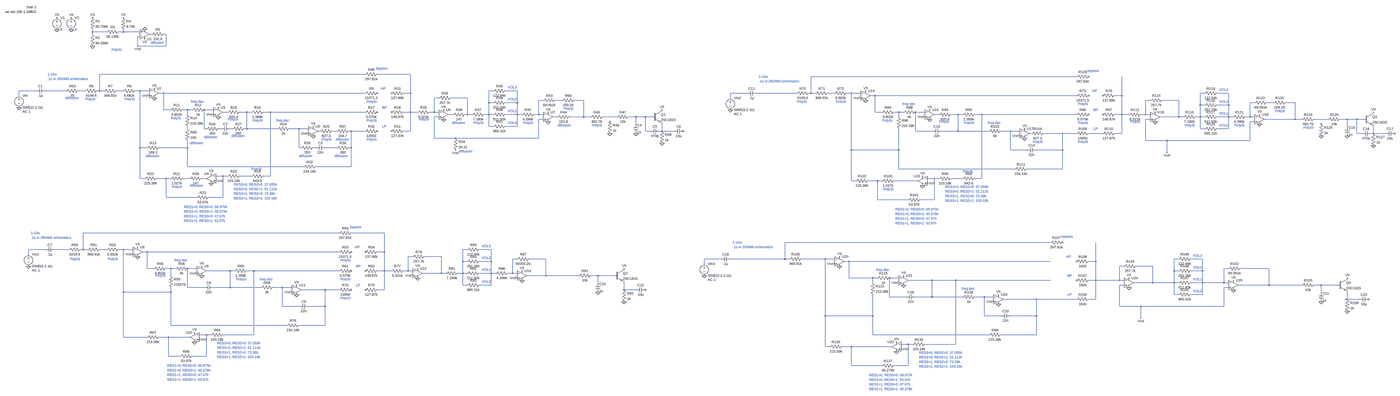
[diagram p0: schematic 8580.asc, whole sheet]
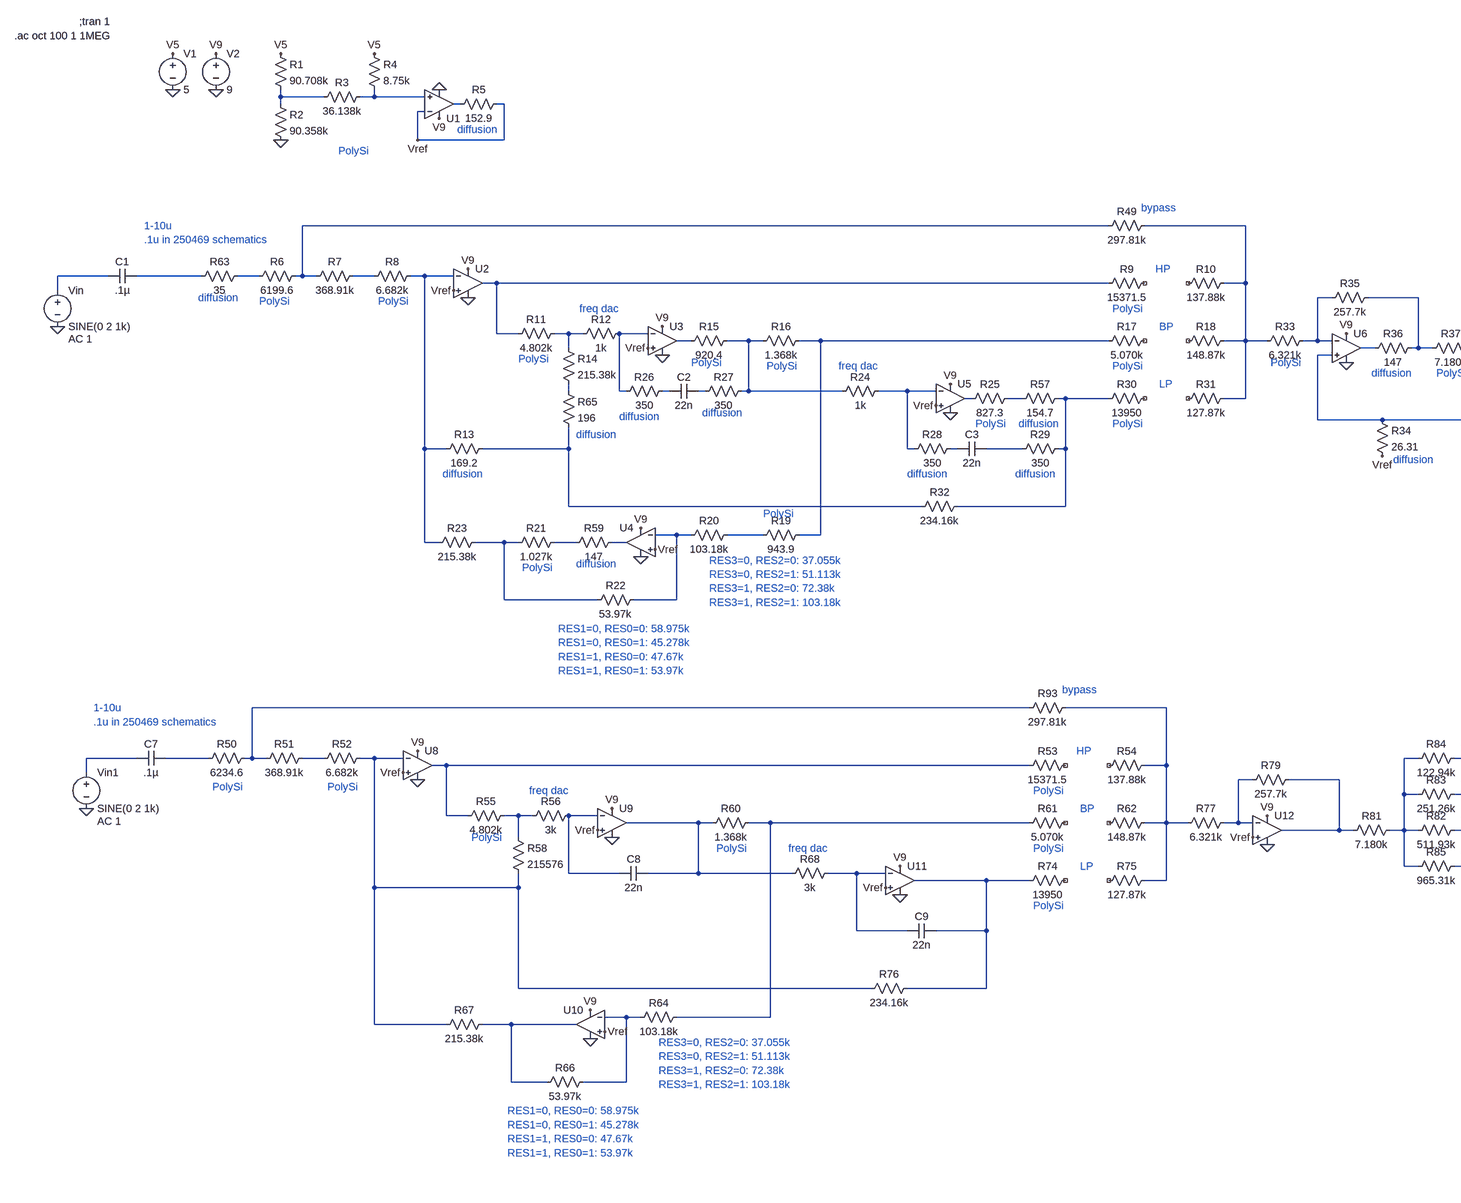
[diagram p1: schematic 8580.asc, part, row 1 of 1, column 1 of 3]
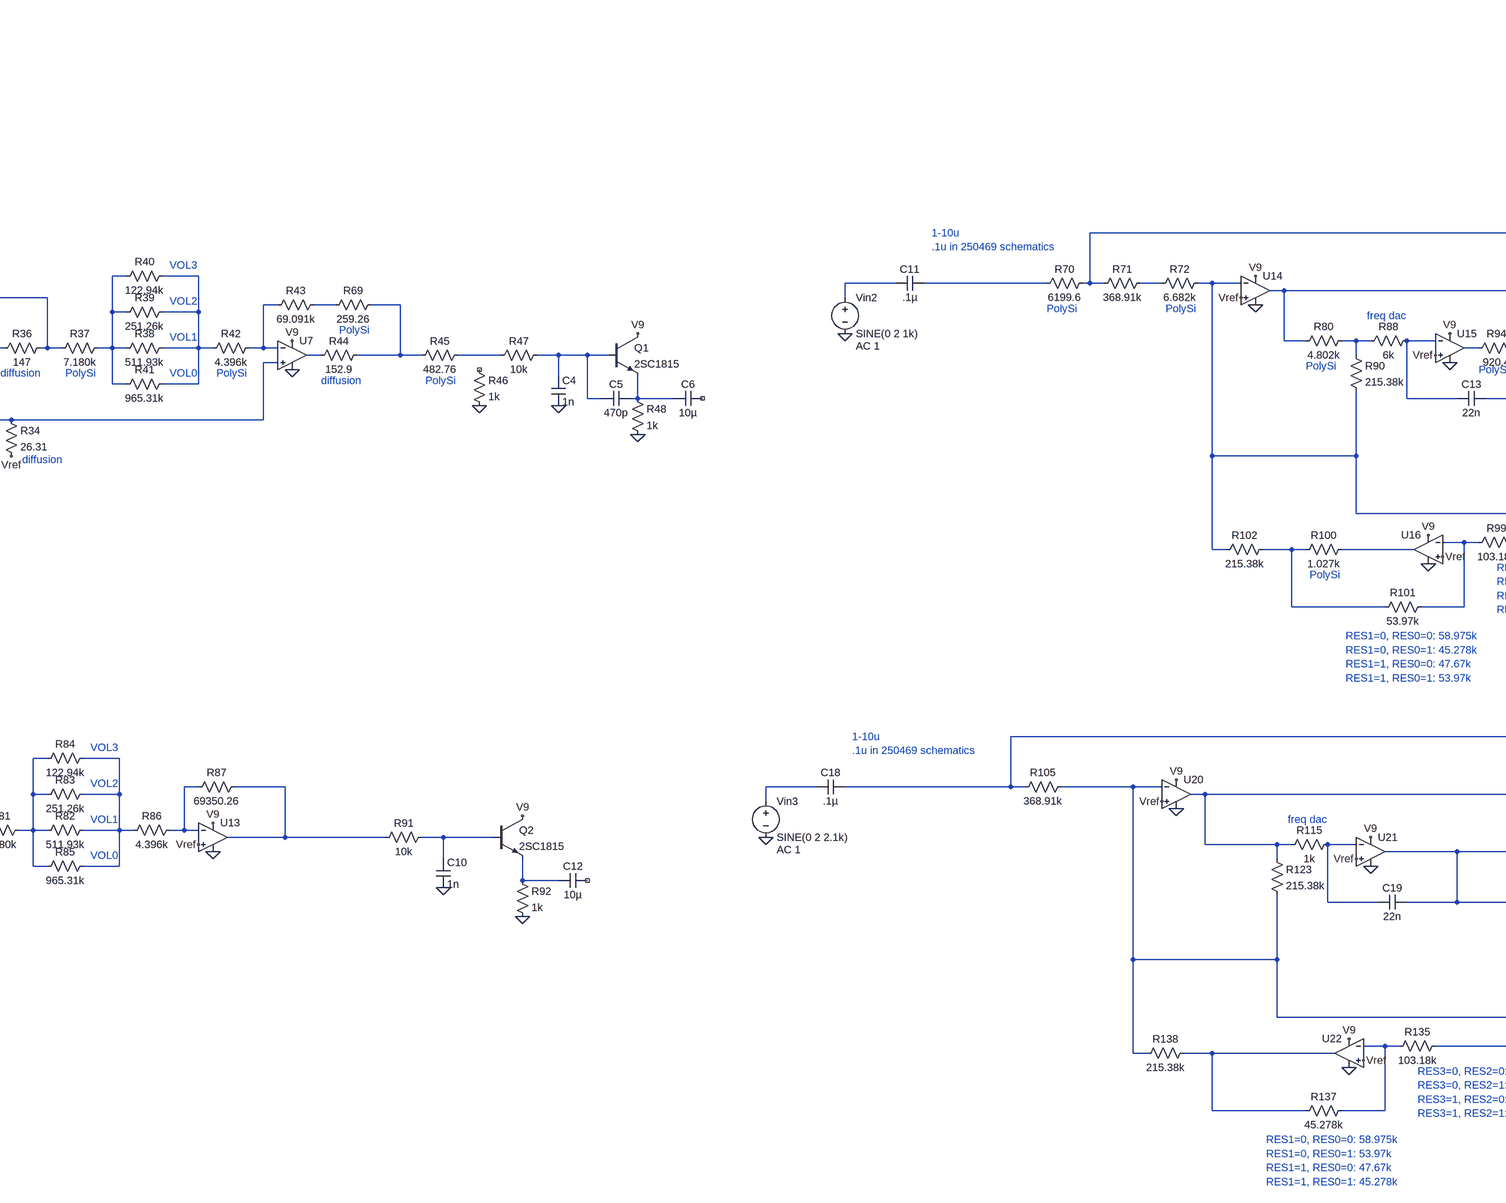
[diagram p2: schematic 8580.asc, part, row 1 of 1, column 2 of 3]
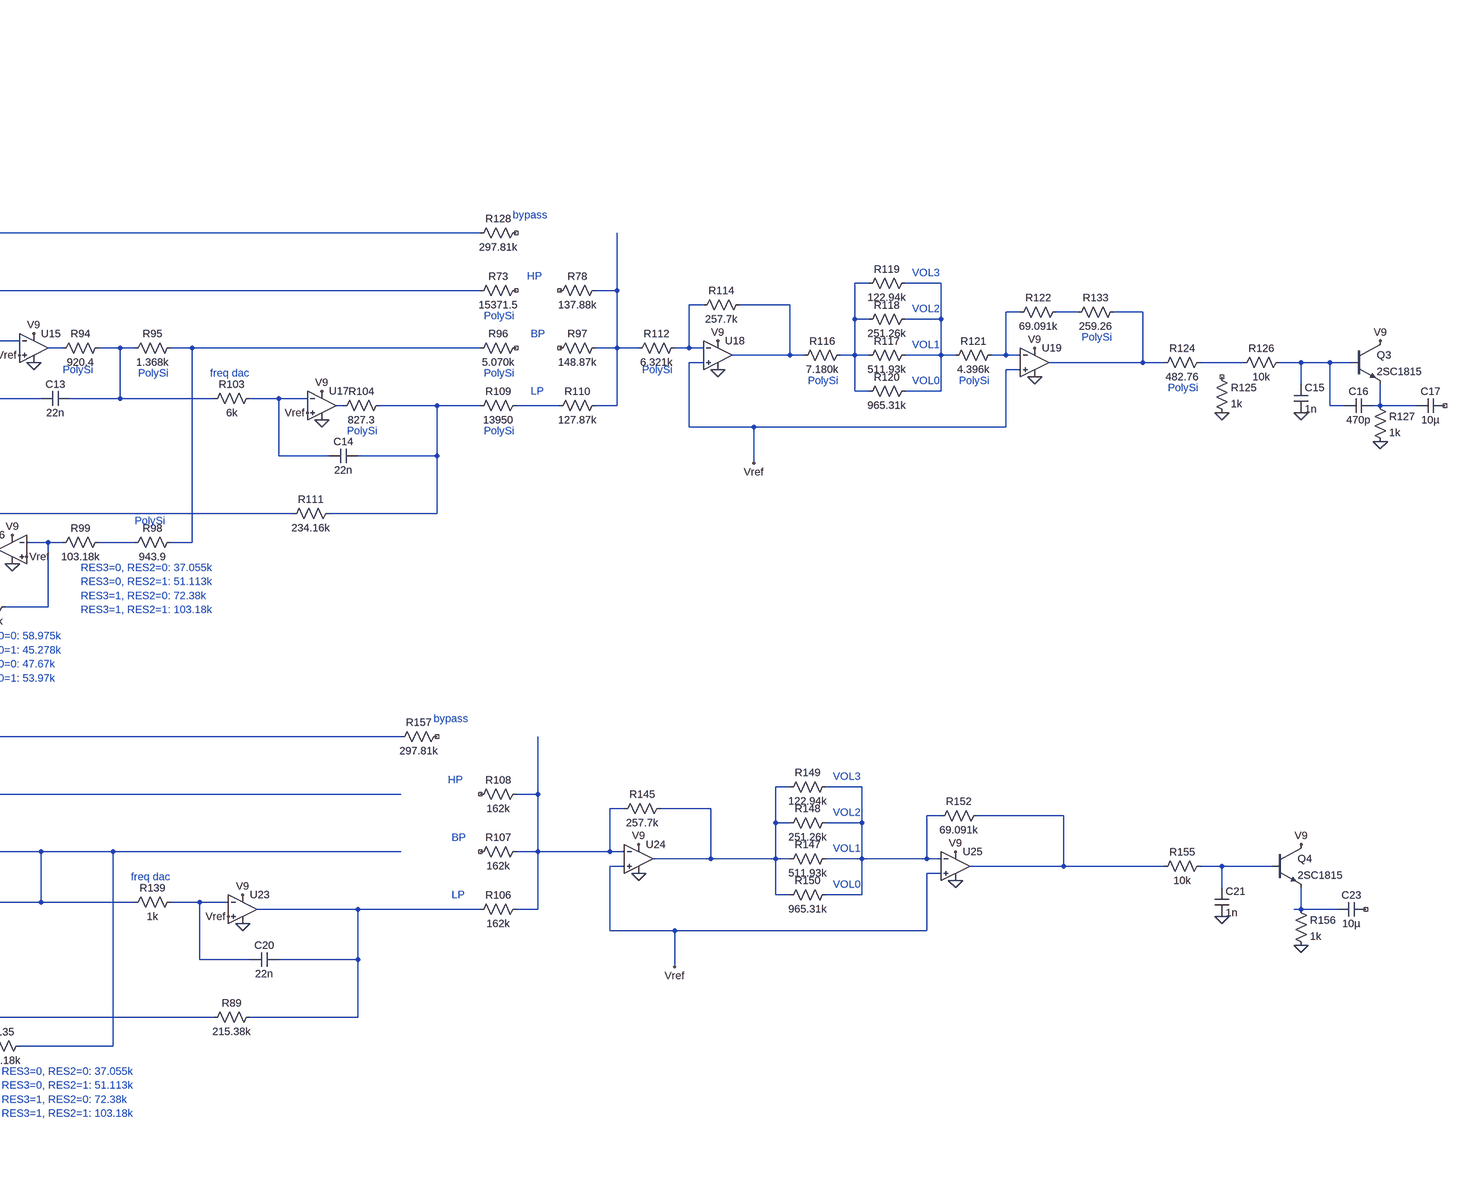
[diagram p3: schematic 8580.asc, part, row 1 of 1, column 3 of 3]
8580.asc, the LTspice schematic file:
Version 4
SHEET 1 9176 2548
WIRE 224 128 224 112
WIRE 320 128 224 128
WIRE 432 128 432 112
WIRE 432 128 400 128
WIRE 544 128 432 128
WIRE 224 144 224 128
WIRE 624 144 608 144
WIRE 720 144 704 144
WIRE 544 160 528 160
WIRE 528 224 528 160
WIRE 720 224 720 144
WIRE 720 224 528 224
WIRE 2064 416 272 416
WIRE 2368 416 2144 416
WIRE 7024 432 5232 432
WIRE -160 528 -272 528
WIRE 48 528 -96 528
WIRE 176 528 128 528
WIRE 272 528 272 416
WIRE 272 528 256 528
WIRE 304 528 272 528
WIRE 432 528 384 528
WIRE 544 528 512 528
WIRE 608 528 544 528
WIRE 2928 528 2896 528
WIRE 3088 528 3008 528
WIRE 704 544 672 544
WIRE 2064 544 704 544
WIRE 2368 544 2368 416
WIRE 2368 544 2320 544
WIRE 4800 544 4688 544
WIRE 5136 544 4864 544
WIRE 5232 544 5232 432
WIRE 5232 544 5216 544
WIRE 5264 544 5232 544
WIRE 5392 544 5344 544
WIRE 5504 544 5472 544
WIRE 5568 544 5504 544
WIRE 7888 544 7856 544
WIRE 8048 544 7968 544
WIRE -272 560 -272 528
WIRE 5664 560 5632 560
WIRE 7024 560 5664 560
WIRE 7328 560 7328 432
WIRE 7328 560 7280 560
WIRE 2560 576 2528 576
WIRE 2752 576 2640 576
WIRE 4688 576 4688 544
WIRE 3264 592 3232 592
WIRE 3392 592 3344 592
WIRE 3536 592 3472 592
WIRE 7520 592 7488 592
WIRE 7712 592 7600 592
WIRE 2896 608 2896 528
WIRE 2928 608 2896 608
WIRE 3088 608 3088 528
WIRE 3088 608 3008 608
WIRE 8224 608 8192 608
WIRE 8352 608 8304 608
WIRE 8496 608 8432 608
WIRE 7856 624 7856 544
WIRE 7888 624 7856 624
WIRE 8048 624 8048 544
WIRE 8048 624 7968 624
WIRE 704 656 704 544
WIRE 752 656 704 656
WIRE 864 656 832 656
WIRE 896 656 864 656
WIRE 1040 656 976 656
WIRE 1136 672 1104 672
WIRE 1264 672 1216 672
WIRE 1296 672 1264 672
WIRE 1424 672 1376 672
WIRE 2064 672 1424 672
WIRE 2368 672 2368 544
WIRE 2368 672 2320 672
WIRE 2416 672 2368 672
WIRE 2528 672 2528 576
WIRE 2528 672 2496 672
WIRE 2560 672 2528 672
WIRE 5664 672 5664 560
WIRE 5712 672 5664 672
WIRE 5824 672 5792 672
WIRE 5856 672 5824 672
WIRE 6000 672 5936 672
WIRE 864 688 864 656
WIRE 2656 688 2624 688
WIRE 2752 688 2752 576
WIRE 2752 688 2736 688
WIRE 2784 688 2752 688
WIRE 2896 688 2896 608
WIRE 2896 688 2864 688
WIRE 2928 688 2896 688
WIRE 3088 688 3088 608
WIRE 3088 688 3008 688
WIRE 3120 688 3088 688
WIRE 3232 688 3232 592
WIRE 3232 688 3200 688
WIRE 3264 688 3232 688
WIRE 6096 688 6064 688
WIRE 6224 688 6176 688
WIRE 6256 688 6224 688
WIRE 6384 688 6336 688
WIRE 7024 688 6384 688
WIRE 7328 688 7328 560
WIRE 7328 688 7280 688
WIRE 7376 688 7328 688
WIRE 7488 688 7488 592
WIRE 7488 688 7456 688
WIRE 7520 688 7488 688
WIRE 2560 704 2528 704
WIRE 3360 704 3328 704
WIRE 3536 704 3536 592
WIRE 3536 704 3440 704
WIRE 3584 704 3536 704
WIRE 3760 704 3664 704
WIRE 3888 704 3840 704
WIRE 3952 704 3888 704
WIRE 4000 704 3952 704
WIRE 5824 704 5824 672
WIRE 7712 704 7712 592
WIRE 7712 704 7584 704
WIRE 7744 704 7712 704
WIRE 7856 704 7856 624
WIRE 7856 704 7824 704
WIRE 7888 704 7856 704
WIRE 8048 704 8048 624
WIRE 8048 704 7968 704
WIRE 8080 704 8048 704
WIRE 8192 704 8192 608
WIRE 8192 704 8160 704
WIRE 8224 704 8192 704
WIRE 3264 720 3232 720
WIRE 7520 720 7488 720
WIRE 8496 720 8496 608
WIRE 8496 720 8288 720
WIRE 8544 720 8496 720
WIRE 8720 720 8624 720
WIRE 8848 720 8800 720
WIRE 8912 720 8848 720
WIRE 8960 720 8912 720
WIRE 8224 736 8192 736
WIRE 3888 752 3888 704
WIRE 2896 768 2896 688
WIRE 2928 768 2896 768
WIRE 3088 768 3088 688
WIRE 3088 768 3008 768
WIRE 8848 768 8848 720
WIRE 864 784 864 768
WIRE 976 784 976 656
WIRE 992 784 976 784
WIRE 1088 784 1072 784
WIRE 1168 784 1152 784
WIRE 1264 784 1264 672
WIRE 1264 784 1248 784
WIRE 1472 784 1264 784
WIRE 1616 784 1552 784
WIRE 1680 784 1616 784
WIRE 7856 784 7856 704
WIRE 7888 784 7856 784
WIRE 8048 784 8048 704
WIRE 8048 784 7968 784
WIRE 1760 800 1744 800
WIRE 1872 800 1840 800
WIRE 1968 800 1952 800
WIRE 2064 800 1968 800
WIRE 2368 800 2368 672
WIRE 2368 800 2320 800
WIRE 3952 800 3952 704
WIRE 3984 800 3952 800
WIRE 4064 800 4064 752
WIRE 4064 800 4048 800
WIRE 4144 800 4064 800
WIRE 5936 800 5936 672
WIRE 6048 800 5936 800
WIRE 6224 800 6224 688
WIRE 6224 800 6112 800
WIRE 6432 800 6224 800
WIRE 6576 800 6512 800
WIRE 6640 800 6576 800
WIRE 6720 816 6704 816
WIRE 6928 816 6800 816
WIRE 7024 816 6928 816
WIRE 7200 816 7104 816
WIRE 7328 816 7328 688
WIRE 7328 816 7280 816
WIRE 8912 816 8912 720
WIRE 8944 816 8912 816
WIRE 9024 816 9024 768
WIRE 9024 816 9008 816
WIRE 9104 816 9024 816
WIRE 2528 848 2528 704
WIRE 2672 848 2528 848
WIRE 3232 848 3232 720
WIRE 3232 848 2672 848
WIRE 7488 864 7488 720
WIRE 7632 864 7488 864
WIRE 8192 864 8192 736
WIRE 8192 864 7632 864
WIRE 544 912 544 528
WIRE 592 912 544 912
WIRE 864 912 864 864
WIRE 864 912 672 912
WIRE 1616 912 1616 784
WIRE 1632 912 1616 912
WIRE 1728 912 1712 912
WIRE 1872 912 1792 912
WIRE 1968 912 1968 800
WIRE 1968 912 1952 912
WIRE 5504 928 5504 544
WIRE 5824 928 5824 784
WIRE 5824 928 5504 928
WIRE 6576 928 6576 800
WIRE 6688 928 6576 928
WIRE 6928 928 6928 816
WIRE 6928 928 6752 928
WIRE 7632 944 7632 864
WIRE 864 1040 864 912
WIRE 1648 1040 864 1040
WIRE 1968 1040 1968 912
WIRE 1968 1040 1728 1040
WIRE 5824 1056 5824 928
WIRE 6608 1056 5824 1056
WIRE 6928 1056 6928 928
WIRE 6928 1056 6688 1056
WIRE 1104 1104 1056 1104
WIRE 1136 1104 1104 1104
WIRE 1296 1104 1216 1104
WIRE 1424 1104 1424 672
WIRE 1424 1104 1376 1104
WIRE 544 1120 544 912
WIRE 576 1120 544 1120
WIRE 720 1120 656 1120
WIRE 752 1120 720 1120
WIRE 880 1120 832 1120
WIRE 992 1120 960 1120
WIRE 6064 1120 6016 1120
WIRE 6096 1120 6064 1120
WIRE 6256 1120 6176 1120
WIRE 6384 1120 6384 688
WIRE 6384 1120 6336 1120
WIRE 5504 1136 5504 928
WIRE 5536 1136 5504 1136
WIRE 5680 1136 5616 1136
WIRE 5712 1136 5680 1136
WIRE 5952 1136 5792 1136
WIRE 720 1248 720 1120
WIRE 928 1248 720 1248
WIRE 1104 1248 1104 1104
WIRE 1104 1248 1008 1248
WIRE 5680 1264 5680 1136
WIRE 5888 1264 5680 1264
WIRE 6064 1264 6064 1120
WIRE 6064 1264 5968 1264
WIRE 1888 1488 160 1488
WIRE 2192 1488 1968 1488
WIRE 6848 1552 5056 1552
WIRE -96 1600 -208 1600
WIRE 64 1600 -32 1600
WIRE 160 1600 160 1488
WIRE 160 1600 144 1600
WIRE 192 1600 160 1600
WIRE 320 1600 272 1600
WIRE 432 1600 400 1600
WIRE 496 1600 432 1600
WIRE 2752 1600 2720 1600
WIRE 2912 1600 2832 1600
WIRE 592 1616 560 1616
WIRE 1888 1616 592 1616
WIRE 2192 1616 2192 1488
WIRE 2192 1616 2144 1616
WIRE -208 1632 -208 1600
WIRE 2384 1648 2352 1648
WIRE 2576 1648 2464 1648
WIRE 3088 1664 3056 1664
WIRE 3280 1664 3168 1664
WIRE 4624 1664 4512 1664
WIRE 5056 1664 5056 1552
WIRE 5056 1664 4688 1664
WIRE 5088 1664 5056 1664
WIRE 5328 1664 5168 1664
WIRE 5392 1664 5328 1664
WIRE 7712 1664 7680 1664
WIRE 7872 1664 7792 1664
WIRE 2720 1680 2720 1600
WIRE 2752 1680 2720 1680
WIRE 2912 1680 2912 1600
WIRE 2912 1680 2832 1680
WIRE 5488 1680 5456 1680
WIRE 6848 1680 5488 1680
WIRE 7152 1680 7152 1552
WIRE 7152 1680 7104 1680
WIRE 4512 1696 4512 1664
WIRE 7344 1712 7312 1712
WIRE 7536 1712 7424 1712
WIRE 592 1728 592 1616
WIRE 640 1728 592 1728
WIRE 752 1728 720 1728
WIRE 784 1728 752 1728
WIRE 928 1728 864 1728
WIRE 8048 1728 8016 1728
WIRE 8320 1728 8128 1728
WIRE 1152 1744 992 1744
WIRE 1184 1744 1152 1744
WIRE 1312 1744 1264 1744
WIRE 1888 1744 1312 1744
WIRE 2192 1744 2192 1616
WIRE 2192 1744 2144 1744
WIRE 2240 1744 2192 1744
WIRE 2352 1744 2352 1648
WIRE 2352 1744 2320 1744
WIRE 2384 1744 2352 1744
WIRE 7680 1744 7680 1664
WIRE 7712 1744 7680 1744
WIRE 7872 1744 7872 1664
WIRE 7872 1744 7792 1744
WIRE 2576 1760 2576 1648
WIRE 2576 1760 2448 1760
WIRE 2608 1760 2576 1760
WIRE 2720 1760 2720 1680
WIRE 2720 1760 2688 1760
WIRE 2752 1760 2720 1760
WIRE 2912 1760 2912 1680
WIRE 2912 1760 2832 1760
WIRE 2944 1760 2912 1760
WIRE 3056 1760 3056 1664
WIRE 3056 1760 3024 1760
WIRE 3088 1760 3056 1760
WIRE 752 1776 752 1728
WIRE 3280 1776 3280 1664
WIRE 3280 1776 3152 1776
WIRE 3504 1776 3280 1776
WIRE 3632 1776 3584 1776
WIRE 3744 1776 3632 1776
WIRE 5488 1792 5488 1680
WIRE 5648 1792 5488 1792
WIRE 5680 1792 5648 1792
WIRE 5824 1792 5760 1792
WIRE 6048 1808 5888 1808
WIRE 6208 1808 6048 1808
WIRE 6848 1808 6208 1808
WIRE 7152 1808 7152 1680
WIRE 7152 1808 7104 1808
WIRE 7312 1808 7312 1712
WIRE 7312 1808 7152 1808
WIRE 7344 1808 7312 1808
WIRE 3632 1824 3632 1776
WIRE 5648 1824 5648 1792
WIRE 7536 1824 7536 1712
WIRE 7536 1824 7408 1824
WIRE 7680 1824 7680 1744
WIRE 7680 1824 7536 1824
WIRE 7712 1824 7680 1824
WIRE 7872 1824 7872 1744
WIRE 7872 1824 7792 1824
WIRE 8016 1824 8016 1728
WIRE 8016 1824 7872 1824
WIRE 8048 1824 8016 1824
WIRE 2720 1840 2720 1760
WIRE 2752 1840 2720 1840
WIRE 2912 1840 2912 1760
WIRE 2912 1840 2832 1840
WIRE 7344 1840 7312 1840
WIRE 8320 1840 8320 1728
WIRE 8320 1840 8112 1840
WIRE 8544 1840 8320 1840
WIRE 8672 1840 8624 1840
WIRE 8784 1840 8672 1840
WIRE 864 1856 864 1728
WIRE 976 1856 864 1856
WIRE 1152 1856 1152 1744
WIRE 1152 1856 1040 1856
WIRE 1360 1856 1152 1856
WIRE 1504 1856 1440 1856
WIRE 1568 1856 1504 1856
WIRE 8048 1856 8016 1856
WIRE 1792 1872 1632 1872
WIRE 1888 1872 1792 1872
WIRE 2192 1872 2192 1744
WIRE 2192 1872 2144 1872
WIRE 3808 1872 3808 1824
WIRE 3888 1872 3808 1872
WIRE 432 1888 432 1600
WIRE 752 1888 752 1856
WIRE 752 1888 432 1888
WIRE 8672 1888 8672 1840
WIRE 7680 1904 7680 1824
WIRE 7712 1904 7680 1904
WIRE 7872 1904 7872 1824
WIRE 7872 1904 7792 1904
WIRE 5760 1920 5760 1792
WIRE 5872 1920 5760 1920
WIRE 6048 1920 6048 1808
WIRE 6048 1920 5936 1920
WIRE 6256 1920 6048 1920
WIRE 6400 1920 6336 1920
WIRE 6464 1920 6400 1920
WIRE 6752 1936 6528 1936
WIRE 7024 1936 6752 1936
WIRE 7152 1936 7152 1808
WIRE 7152 1936 7104 1936
WIRE 8848 1936 8848 1888
WIRE 8848 1936 8832 1936
WIRE 8928 1936 8848 1936
WIRE 1504 1984 1504 1856
WIRE 1616 1984 1504 1984
WIRE 1792 1984 1792 1872
WIRE 1792 1984 1680 1984
WIRE 7312 1984 7312 1840
WIRE 7456 1984 7312 1984
WIRE 8016 1984 8016 1856
WIRE 8016 1984 7456 1984
WIRE 5328 2048 5328 1664
WIRE 5648 2048 5648 1904
WIRE 5648 2048 5328 2048
WIRE 6400 2048 6400 1920
WIRE 6512 2048 6400 2048
WIRE 6752 2048 6752 1936
WIRE 6752 2048 6576 2048
WIRE 7456 2064 7456 1984
WIRE 752 2112 752 1888
WIRE 1536 2112 752 2112
WIRE 1792 2112 1792 1984
WIRE 1792 2112 1616 2112
WIRE 992 2176 944 2176
WIRE 1024 2176 992 2176
WIRE 1312 2176 1312 1744
WIRE 1312 2176 1104 2176
WIRE 5648 2176 5648 2048
WIRE 6432 2176 5648 2176
WIRE 6752 2176 6752 2048
WIRE 6752 2176 6512 2176
WIRE 432 2192 432 1888
WIRE 592 2192 432 2192
WIRE 736 2192 672 2192
WIRE 880 2192 736 2192
WIRE 5888 2240 5840 2240
WIRE 5920 2240 5888 2240
WIRE 6208 2240 6208 1808
WIRE 6208 2240 6000 2240
WIRE 5328 2256 5328 2048
WIRE 5360 2256 5328 2256
WIRE 5504 2256 5440 2256
WIRE 5776 2256 5504 2256
WIRE 736 2320 736 2192
WIRE 816 2320 736 2320
WIRE 992 2320 992 2176
WIRE 992 2320 896 2320
WIRE 5504 2384 5504 2256
WIRE 5712 2384 5504 2384
WIRE 5888 2384 5888 2240
WIRE 5888 2384 5792 2384
FLAG -16 112 0
FLAG -16 32 V5
FLAG 80 112 0
FLAG 80 32 V9
FLAG 224 32 V5
FLAG 224 224 0
FLAG 432 32 V5
FLAG 576 112 0
FLAG 576 176 V9
FLAG 528 224 Vref
FLAG -272 640 0
FLAG 640 576 0
FLAG 640 512 V9
FLAG 608 560 Vref
FLAG 1072 704 0
FLAG 1072 640 V9
FLAG 1040 688 Vref
FLAG 1024 1152 0
FLAG 1024 1088 V9
FLAG 1056 1136 Vref
FLAG 1712 832 0
FLAG 1712 768 V9
FLAG 1680 816 Vref
FLAG 2592 720 0
FLAG 2592 656 V9
FLAG 2672 928 Vref
FLAG 3296 736 0
FLAG 3296 672 V9
FLAG 3712 816 0
FLAG 3888 816 0
FLAG 4064 880 0
FLAG 4064 656 V9
FLAG -208 1712 0
FLAG 528 1648 0
FLAG 528 1584 V9
FLAG 496 1632 Vref
FLAG 960 1776 0
FLAG 960 1712 V9
FLAG 928 1760 Vref
FLAG 912 2224 0
FLAG 912 2160 V9
FLAG 944 2208 Vref
FLAG 1600 1904 0
FLAG 1600 1840 V9
FLAG 1568 1888 Vref
FLAG 2416 1792 0
FLAG 2416 1728 V9
FLAG 2384 1776 Vref
FLAG 3120 1808 0
FLAG 3120 1744 V9
FLAG 3632 1888 0
FLAG 3808 1952 0
FLAG 3808 1728 V9
FLAG 3088 1792 Vref
FLAG 4688 656 0
FLAG 5600 592 0
FLAG 5600 528 V9
FLAG 5568 576 Vref
FLAG 6032 720 0
FLAG 6032 656 V9
FLAG 6000 704 Vref
FLAG 5984 1168 0
FLAG 5984 1104 V9
FLAG 6016 1152 Vref
FLAG 6672 848 0
FLAG 6672 784 V9
FLAG 6640 832 Vref
FLAG 7552 736 0
FLAG 7552 672 V9
FLAG 7632 944 Vref
FLAG 8256 752 0
FLAG 8256 688 V9
FLAG 8672 832 0
FLAG 8848 832 0
FLAG 9024 896 0
FLAG 9024 672 V9
FLAG 4512 1776 0
FLAG 5424 1712 0
FLAG 5424 1648 V9
FLAG 5392 1696 Vref
FLAG 5856 1840 0
FLAG 5856 1776 V9
FLAG 5824 1824 Vref
FLAG 5808 2288 0
FLAG 5808 2224 V9
FLAG 5840 2272 Vref
FLAG 6496 1968 0
FLAG 6496 1904 V9
FLAG 6464 1952 Vref
FLAG 7376 1856 0
FLAG 7376 1792 V9
FLAG 7456 2064 Vref
FLAG 8080 1872 0
FLAG 8080 1808 V9
FLAG 8672 1952 0
FLAG 8848 2016 0
FLAG 8848 1792 V9
SYMBOL voltage -16 16 R0
WINDOW 123 0 0 Left 0
WINDOW 39 0 0 Left 0
SYMATTR InstName V1
SYMATTR Value 5
SYMBOL voltage 80 16 R0
WINDOW 123 0 0 Left 0
WINDOW 39 0 0 Left 0
SYMATTR InstName V2
SYMATTR Value 9
SYMBOL res 208 16 R0
SYMATTR InstName R1
SYMATTR Value 90.708k
SYMBOL res 208 128 R0
SYMATTR InstName R2
SYMATTR Value 90.358k
SYMBOL res 416 112 R90
WINDOW 0 0 56 VBottom 2
WINDOW 3 32 56 VTop 2
SYMATTR InstName R3
SYMATTR Value 36.138k
SYMBOL res 416 16 R0
SYMATTR InstName R4
SYMATTR Value 8.75k
SYMBOL Opamps\\UniversalOpamp2 576 144 M180
SYMATTR InstName U1
SYMBOL res 720 128 R90
WINDOW 0 0 56 VBottom 2
WINDOW 3 32 56 VTop 2
SYMATTR InstName R5
SYMATTR Value 152.9
SYMBOL voltage -272 544 R0
WINDOW 123 24 124 Left 2
WINDOW 39 0 0 Left 0
SYMATTR Value2 AC 1
SYMATTR InstName Vin
SYMATTR Value SINE(0 2 1k)
SYMBOL res 272 512 R90
WINDOW 0 0 56 VBottom 2
WINDOW 3 32 56 VTop 2
SYMATTR InstName R6
SYMATTR Value 6199.6
SYMBOL res 400 512 R90
WINDOW 0 0 56 VBottom 2
WINDOW 3 32 56 VTop 2
SYMATTR InstName R7
SYMATTR Value 368.91k
SYMBOL res 528 512 R90
WINDOW 0 0 56 VBottom 2
WINDOW 3 32 56 VTop 2
SYMATTR InstName R8
SYMATTR Value 6.682k
SYMBOL Opamps\\UniversalOpamp2 640 544 R0
SYMATTR InstName U2
SYMBOL cap -96 512 R90
WINDOW 0 0 32 VBottom 2
WINDOW 3 32 32 VTop 2
SYMATTR InstName C1
SYMATTR Value .1µ
SYMBOL res 2160 528 R90
WINDOW 0 0 56 VBottom 2
WINDOW 3 32 56 VTop 2
SYMATTR InstName R9
SYMATTR Value 15371.5
SYMBOL res 2336 528 R90
WINDOW 0 0 56 VBottom 2
WINDOW 3 32 56 VTop 2
SYMATTR InstName R10
SYMATTR Value 137.88k
SYMBOL res 848 640 R90
WINDOW 0 0 56 VBottom 2
WINDOW 3 32 56 VTop 2
SYMATTR InstName R11
SYMATTR Value 4.802k
SYMBOL res 992 640 R90
WINDOW 0 0 56 VBottom 2
WINDOW 3 32 56 VTop 2
SYMATTR InstName R12
SYMATTR Value 1k
SYMBOL res 688 896 R90
WINDOW 0 0 56 VBottom 2
WINDOW 3 32 56 VTop 2
SYMATTR InstName R13
SYMATTR Value 169.2
SYMBOL res 848 672 R0
SYMATTR InstName R14
SYMATTR Value 215.38k
SYMBOL Opamps\\UniversalOpamp2 1072 672 R0
SYMATTR InstName U3
SYMBOL res 1232 656 R90
WINDOW 0 0 56 VBottom 2
WINDOW 3 32 56 VTop 2
SYMATTR InstName R15
SYMATTR Value 920.4
SYMBOL cap 1152 768 R90
WINDOW 0 0 32 VBottom 2
WINDOW 3 32 32 VTop 2
SYMATTR InstName C2
SYMATTR Value 22n
SYMBOL res 1392 656 R90
WINDOW 0 0 56 VBottom 2
WINDOW 3 32 56 VTop 2
SYMATTR InstName R16
SYMATTR Value 1.368k
SYMBOL res 2160 656 R90
WINDOW 0 0 56 VBottom 2
WINDOW 3 32 56 VTop 2
SYMATTR InstName R17
SYMATTR Value 5.070k
SYMBOL res 2336 656 R90
WINDOW 0 0 56 VBottom 2
WINDOW 3 32 56 VTop 2
SYMATTR InstName R18
SYMATTR Value 148.87k
SYMBOL res 1392 1088 R90
WINDOW 0 0 56 VBottom 2
WINDOW 3 32 56 VTop 2
SYMATTR InstName R19
SYMATTR Value 943.9
SYMBOL res 1232 1088 R90
WINDOW 0 0 56 VBottom 2
WINDOW 3 32 56 VTop 2
SYMATTR InstName R20
SYMATTR Value 103.18k
SYMBOL Opamps\\UniversalOpamp2 1024 1120 M0
SYMATTR InstName U4
SYMBOL res 848 1104 R90
WINDOW 0 0 56 VBottom 2
WINDOW 3 32 56 VTop 2
SYMATTR InstName R21
SYMATTR Value 1.027k
SYMBOL res 1024 1232 R90
WINDOW 0 0 56 VBottom 2
WINDOW 3 32 56 VTop 2
SYMATTR InstName R22
SYMATTR Value 53.97k
SYMBOL res 672 1104 R90
WINDOW 0 0 56 VBottom 2
WINDOW 3 32 56 VTop 2
SYMATTR InstName R23
SYMATTR Value 215.38k
SYMBOL res 1568 768 R90
WINDOW 0 0 56 VBottom 2
WINDOW 3 32 56 VTop 2
SYMATTR InstName R24
SYMATTR Value 1k
SYMBOL Opamps\\UniversalOpamp2 1712 800 R0
SYMATTR InstName U5
SYMBOL res 1856 784 R90
WINDOW 0 0 56 VBottom 2
WINDOW 3 32 56 VTop 2
SYMATTR InstName R25
SYMATTR Value 827.3
SYMBOL res 1088 768 R90
WINDOW 0 0 56 VBottom 2
WINDOW 3 32 56 VTop 2
SYMATTR InstName R26
SYMATTR Value 350
SYMBOL res 1264 768 R90
WINDOW 0 0 56 VBottom 2
WINDOW 3 32 56 VTop 2
SYMATTR InstName R27
SYMATTR Value 350
SYMBOL cap 1792 896 R90
WINDOW 0 0 32 VBottom 2
WINDOW 3 32 32 VTop 2
SYMATTR InstName C3
SYMATTR Value 22n
SYMBOL res 1728 896 R90
WINDOW 0 0 56 VBottom 2
WINDOW 3 32 56 VTop 2
SYMATTR InstName R28
SYMATTR Value 350
SYMBOL res 1968 896 R90
WINDOW 0 0 56 VBottom 2
WINDOW 3 32 56 VTop 2
SYMATTR InstName R29
SYMATTR Value 350
SYMBOL res 2160 784 R90
WINDOW 0 0 56 VBottom 2
WINDOW 3 32 56 VTop 2
SYMATTR InstName R30
SYMATTR Value 13950
SYMBOL res 2336 784 R90
WINDOW 0 0 56 VBottom 2
WINDOW 3 32 56 VTop 2
SYMATTR InstName R31
SYMATTR Value 127.87k
SYMBOL res 1744 1024 R90
WINDOW 0 0 56 VBottom 2
WINDOW 3 32 56 VTop 2
SYMATTR InstName R32
SYMATTR Value 234.16k
SYMBOL res 2512 656 R90
WINDOW 0 0 56 VBottom 2
WINDOW 3 32 56 VTop 2
SYMATTR InstName R33
SYMATTR Value 6.321k
SYMBOL Opamps\\UniversalOpamp2 2592 688 R0
SYMATTR InstName U6
SYMBOL res 2656 832 R0
SYMATTR InstName R34
SYMATTR Value 26.31
SYMBOL res 2656 560 R90
WINDOW 0 0 56 VBottom 2
WINDOW 3 32 56 VTop 2
SYMATTR InstName R35
SYMATTR Value 257.7k
SYMBOL res 2752 672 R90
WINDOW 0 0 56 VBottom 2
WINDOW 3 32 56 VTop 2
SYMATTR InstName R36
SYMATTR Value 147
SYMBOL res 2880 672 R90
WINDOW 0 0 56 VBottom 2
WINDOW 3 32 56 VTop 2
SYMATTR InstName R37
SYMATTR Value 7.180k
SYMBOL res 3024 672 R90
WINDOW 0 0 56 VBottom 2
WINDOW 3 32 56 VTop 2
SYMATTR InstName R38
SYMATTR Value 511.93k
SYMBOL res 3024 592 R90
WINDOW 0 0 56 VBottom 2
WINDOW 3 32 56 VTop 2
SYMATTR InstName R39
SYMATTR Value 251.26k
SYMBOL res 3024 512 R90
WINDOW 0 0 56 VBottom 2
WINDOW 3 32 56 VTop 2
SYMATTR InstName R40
SYMATTR Value 122.94k
SYMBOL res 3024 752 R90
WINDOW 0 0 56 VBottom 2
WINDOW 3 32 56 VTop 2
SYMATTR InstName R41
SYMATTR Value 965.31k
SYMBOL res 3216 672 R90
WINDOW 0 0 56 VBottom 2
WINDOW 3 32 56 VTop 2
SYMATTR InstName R42
SYMATTR Value 4.396k
SYMBOL Opamps\\UniversalOpamp2 3296 704 R0
SYMATTR InstName U7
SYMBOL res 3360 576 R90
WINDOW 0 0 56 VBottom 2
WINDOW 3 32 56 VTop 2
SYMATTR InstName R43
SYMATTR Value 69.091k
SYMBOL res 3456 688 R90
WINDOW 0 0 56 VBottom 2
WINDOW 3 32 56 VTop 2
SYMATTR InstName R44
SYMATTR Value 152.9
SYMBOL res 3680 688 R90
WINDOW 0 0 56 VBottom 2
WINDOW 3 32 56 VTop 2
SYMATTR InstName R45
SYMATTR Value 482.76
SYMBOL res 3696 720 R0
SYMATTR InstName R46
SYMATTR Value 1k
SYMBOL res 3856 688 R90
WINDOW 0 0 56 VBottom 2
WINDOW 3 32 56 VTop 2
SYMATTR InstName R47
SYMATTR Value 10k
SYMBOL cap 3872 752 R0
SYMATTR InstName C4
SYMATTR Value 1n
SYMBOL npn 4000 656 R0
SYMATTR InstName Q1
SYMATTR Value 2SC1815
SYMBOL cap 4048 784 R90
WINDOW 0 0 32 VBottom 2
WINDOW 3 32 32 VTop 2
SYMATTR InstName C5
SYMATTR Value 470p
SYMBOL res 4048 784 R0
SYMATTR InstName R48
SYMATTR Value 1k
SYMBOL cap 4208 784 R90
WINDOW 0 0 32 VBottom 2
WINDOW 3 32 32 VTop 2
SYMATTR InstName C6
SYMATTR Value 10µ
SYMBOL res 2160 400 R90
WINDOW 0 0 56 VBottom 2
WINDOW 3 32 56 VTop 2
SYMATTR InstName R49
SYMATTR Value 297.81k
SYMBOL voltage -208 1616 R0
WINDOW 123 24 124 Left 2
WINDOW 39 0 0 Left 0
SYMATTR Value2 AC 1
SYMATTR InstName Vin1
SYMATTR Value SINE(0 2 1k)
SYMBOL res 160 1584 R90
WINDOW 0 0 56 VBottom 2
WINDOW 3 32 56 VTop 2
SYMATTR InstName R50
SYMATTR Value 6234.6
SYMBOL res 288 1584 R90
WINDOW 0 0 56 VBottom 2
WINDOW 3 32 56 VTop 2
SYMATTR InstName R51
SYMATTR Value 368.91k
SYMBOL res 416 1584 R90
WINDOW 0 0 56 VBottom 2
WINDOW 3 32 56 VTop 2
SYMATTR InstName R52
SYMATTR Value 6.682k
SYMBOL Opamps\\UniversalOpamp2 528 1616 R0
SYMATTR InstName U8
SYMBOL cap -32 1584 R90
WINDOW 0 0 32 VBottom 2
WINDOW 3 32 32 VTop 2
SYMATTR InstName C7
SYMATTR Value .1µ
SYMBOL res 1984 1600 R90
WINDOW 0 0 56 VBottom 2
WINDOW 3 32 56 VTop 2
SYMATTR InstName R53
SYMATTR Value 15371.5
SYMBOL res 2160 1600 R90
WINDOW 0 0 56 VBottom 2
WINDOW 3 32 56 VTop 2
SYMATTR InstName R54
SYMATTR Value 137.88k
SYMBOL res 736 1712 R90
WINDOW 0 0 56 VBottom 2
WINDOW 3 32 56 VTop 2
SYMATTR InstName R55
SYMATTR Value 4.802k
SYMBOL res 880 1712 R90
WINDOW 0 0 56 VBottom 2
WINDOW 3 32 56 VTop 2
SYMATTR InstName R56
SYMATTR Value 3k
SYMBOL res 736 1760 R0
SYMATTR InstName R58
SYMATTR Value 215576
SYMBOL Opamps\\UniversalOpamp2 960 1744 R0
SYMATTR InstName U9
SYMBOL cap 1040 1840 R90
WINDOW 0 0 32 VBottom 2
WINDOW 3 32 32 VTop 2
SYMATTR InstName C8
SYMATTR Value 22n
SYMBOL res 1280 1728 R90
WINDOW 0 0 56 VBottom 2
WINDOW 3 32 56 VTop 2
SYMATTR InstName R60
SYMATTR Value 1.368k
SYMBOL res 1984 1728 R90
WINDOW 0 0 56 VBottom 2
WINDOW 3 32 56 VTop 2
SYMATTR InstName R61
SYMATTR Value 5.070k
SYMBOL res 2160 1728 R90
WINDOW 0 0 56 VBottom 2
WINDOW 3 32 56 VTop 2
SYMATTR InstName R62
SYMATTR Value 148.87k
SYMBOL res 1120 2160 R90
WINDOW 0 0 56 VBottom 2
WINDOW 3 32 56 VTop 2
SYMATTR InstName R64
SYMATTR Value 103.18k
SYMBOL Opamps\\UniversalOpamp2 912 2192 M0
SYMATTR InstName U10
SYMBOL res 912 2304 R90
WINDOW 0 0 56 VBottom 2
WINDOW 3 32 56 VTop 2
SYMATTR InstName R66
SYMATTR Value 53.97k
SYMBOL res 688 2176 R90
WINDOW 0 0 56 VBottom 2
WINDOW 3 32 56 VTop 2
SYMATTR InstName R67
SYMATTR Value 215.38k
SYMBOL res 1456 1840 R90
WINDOW 0 0 56 VBottom 2
WINDOW 3 32 56 VTop 2
SYMATTR InstName R68
SYMATTR Value 3k
SYMBOL Opamps\\UniversalOpamp2 1600 1872 R0
SYMATTR InstName U11
SYMBOL cap 1680 1968 R90
WINDOW 0 0 32 VBottom 2
WINDOW 3 32 32 VTop 2
SYMATTR InstName C9
SYMATTR Value 22n
SYMBOL res 1984 1856 R90
WINDOW 0 0 56 VBottom 2
WINDOW 3 32 56 VTop 2
SYMATTR InstName R74
SYMATTR Value 13950
SYMBOL res 2160 1856 R90
WINDOW 0 0 56 VBottom 2
WINDOW 3 32 56 VTop 2
SYMATTR InstName R75
SYMATTR Value 127.87k
SYMBOL res 1632 2096 R90
WINDOW 0 0 56 VBottom 2
WINDOW 3 32 56 VTop 2
SYMATTR InstName R76
SYMATTR Value 234.16k
SYMBOL res 2336 1728 R90
WINDOW 0 0 56 VBottom 2
WINDOW 3 32 56 VTop 2
SYMATTR InstName R77
SYMATTR Value 6.321k
SYMBOL Opamps\\UniversalOpamp2 2416 1760 R0
SYMATTR InstName U12
SYMBOL res 2480 1632 R90
WINDOW 0 0 56 VBottom 2
WINDOW 3 32 56 VTop 2
SYMATTR InstName R79
SYMATTR Value 257.7k
SYMBOL res 2704 1744 R90
WINDOW 0 0 56 VBottom 2
WINDOW 3 32 56 VTop 2
SYMATTR InstName R81
SYMATTR Value 7.180k
SYMBOL res 2848 1744 R90
WINDOW 0 0 56 VBottom 2
WINDOW 3 32 56 VTop 2
SYMATTR InstName R82
SYMATTR Value 511.93k
SYMBOL res 2848 1664 R90
WINDOW 0 0 56 VBottom 2
WINDOW 3 32 56 VTop 2
SYMATTR InstName R83
SYMATTR Value 251.26k
SYMBOL res 2848 1584 R90
WINDOW 0 0 56 VBottom 2
WINDOW 3 32 56 VTop 2
SYMATTR InstName R84
SYMATTR Value 122.94k
SYMBOL res 2848 1824 R90
WINDOW 0 0 56 VBottom 2
WINDOW 3 32 56 VTop 2
SYMATTR InstName R85
SYMATTR Value 965.31k
SYMBOL res 3040 1744 R90
WINDOW 0 0 56 VBottom 2
WINDOW 3 32 56 VTop 2
SYMATTR InstName R86
SYMATTR Value 4.396k
SYMBOL Opamps\\UniversalOpamp2 3120 1776 R0
SYMATTR InstName U13
SYMBOL res 3184 1648 R90
WINDOW 0 0 56 VBottom 2
WINDOW 3 32 56 VTop 2
SYMATTR InstName R87
SYMATTR Value 69350.26
SYMBOL res 3600 1760 R90
WINDOW 0 0 56 VBottom 2
WINDOW 3 32 56 VTop 2
SYMATTR InstName R91
SYMATTR Value 10k
SYMBOL cap 3616 1824 R0
SYMATTR InstName C10
SYMATTR Value 1n
SYMBOL npn 3744 1728 R0
SYMATTR InstName Q2
SYMATTR Value 2SC1815
SYMBOL res 3792 1856 R0
SYMATTR InstName R92
SYMATTR Value 1k
SYMBOL cap 3952 1856 R90
WINDOW 0 0 32 VBottom 2
WINDOW 3 32 32 VTop 2
SYMATTR InstName C12
SYMATTR Value 10µ
SYMBOL res 1984 1472 R90
WINDOW 0 0 56 VBottom 2
WINDOW 3 32 56 VTop 2
SYMATTR InstName R93
SYMATTR Value 297.81k
SYMBOL res 1968 784 R90
WINDOW 0 0 56 VBottom 2
WINDOW 3 32 56 VTop 2
SYMATTR InstName R57
SYMATTR Value 154.7
SYMBOL res 976 1104 R90
WINDOW 0 0 56 VBottom 2
WINDOW 3 32 56 VTop 2
SYMATTR InstName R59
SYMATTR Value 147
SYMBOL res 144 512 R90
WINDOW 0 0 56 VBottom 2
WINDOW 3 32 56 VTop 2
SYMATTR InstName R63
SYMATTR Value 35
SYMBOL res 848 768 R0
SYMATTR InstName R65
SYMATTR Value 196
SYMBOL res 3488 576 R90
WINDOW 0 0 56 VBottom 2
WINDOW 3 32 56 VTop 2
SYMATTR InstName R69
SYMATTR Value 259.26
SYMBOL voltage 4688 560 R0
WINDOW 123 24 124 Left 2
WINDOW 39 0 0 Left 0
SYMATTR Value2 AC 1
SYMATTR InstName Vin2
SYMATTR Value SINE(0 2 1k)
SYMBOL res 5232 528 R90
WINDOW 0 0 56 VBottom 2
WINDOW 3 32 56 VTop 2
SYMATTR InstName R70
SYMATTR Value 6199.6
SYMBOL res 5360 528 R90
WINDOW 0 0 56 VBottom 2
WINDOW 3 32 56 VTop 2
SYMATTR InstName R71
SYMATTR Value 368.91k
SYMBOL res 5488 528 R90
WINDOW 0 0 56 VBottom 2
WINDOW 3 32 56 VTop 2
SYMATTR InstName R72
SYMATTR Value 6.682k
SYMBOL Opamps\\UniversalOpamp2 5600 560 R0
SYMATTR InstName U14
SYMBOL cap 4864 528 R90
WINDOW 0 0 32 VBottom 2
WINDOW 3 32 32 VTop 2
SYMATTR InstName C11
SYMATTR Value .1µ
SYMBOL res 7120 544 R90
WINDOW 0 0 56 VBottom 2
WINDOW 3 32 56 VTop 2
SYMATTR InstName R73
SYMATTR Value 15371.5
SYMBOL res 7296 544 R90
WINDOW 0 0 56 VBottom 2
WINDOW 3 32 56 VTop 2
SYMATTR InstName R78
SYMATTR Value 137.88k
SYMBOL res 5808 656 R90
WINDOW 0 0 56 VBottom 2
WINDOW 3 32 56 VTop 2
SYMATTR InstName R80
SYMATTR Value 4.802k
SYMBOL res 5952 656 R90
WINDOW 0 0 56 VBottom 2
WINDOW 3 32 56 VTop 2
SYMATTR InstName R88
SYMATTR Value 6k
SYMBOL res 5808 688 R0
SYMATTR InstName R90
SYMATTR Value 215.38k
SYMBOL Opamps\\UniversalOpamp2 6032 688 R0
SYMATTR InstName U15
SYMBOL res 6192 672 R90
WINDOW 0 0 56 VBottom 2
WINDOW 3 32 56 VTop 2
SYMATTR InstName R94
SYMATTR Value 920.4
SYMBOL cap 6112 784 R90
WINDOW 0 0 32 VBottom 2
WINDOW 3 32 32 VTop 2
SYMATTR InstName C13
SYMATTR Value 22n
SYMBOL res 6352 672 R90
WINDOW 0 0 56 VBottom 2
WINDOW 3 32 56 VTop 2
SYMATTR InstName R95
SYMATTR Value 1.368k
SYMBOL res 7120 672 R90
WINDOW 0 0 56 VBottom 2
WINDOW 3 32 56 VTop 2
SYMATTR InstName R96
SYMATTR Value 5.070k
SYMBOL res 7296 672 R90
WINDOW 0 0 56 VBottom 2
WINDOW 3 32 56 VTop 2
SYMATTR InstName R97
SYMATTR Value 148.87k
SYMBOL res 6352 1104 R90
WINDOW 0 0 56 VBottom 2
WINDOW 3 32 56 VTop 2
SYMATTR InstName R98
SYMATTR Value 943.9
SYMBOL res 6192 1104 R90
WINDOW 0 0 56 VBottom 2
WINDOW 3 32 56 VTop 2
SYMATTR InstName R99
SYMATTR Value 103.18k
SYMBOL Opamps\\UniversalOpamp2 5984 1136 M0
SYMATTR InstName U16
SYMBOL res 5808 1120 R90
WINDOW 0 0 56 VBottom 2
WINDOW 3 32 56 VTop 2
SYMATTR InstName R100
SYMATTR Value 1.027k
SYMBOL res 5984 1248 R90
WINDOW 0 0 56 VBottom 2
WINDOW 3 32 56 VTop 2
SYMATTR InstName R101
SYMATTR Value 53.97k
SYMBOL res 5632 1120 R90
WINDOW 0 0 56 VBottom 2
WINDOW 3 32 56 VTop 2
SYMATTR InstName R102
SYMATTR Value 215.38k
SYMBOL res 6528 784 R90
WINDOW 0 0 56 VBottom 2
WINDOW 3 32 56 VTop 2
SYMATTR InstName R103
SYMATTR Value 6k
SYMBOL Opamps\\UniversalOpamp2 6672 816 R0
SYMATTR InstName U17
SYMBOL res 6816 800 R90
WINDOW 0 0 56 VBottom 2
WINDOW 3 32 56 VTop 2
SYMATTR InstName R104
SYMATTR Value 827.3
SYMBOL cap 6752 912 R90
WINDOW 0 0 32 VBottom 2
WINDOW 3 32 32 VTop 2
SYMATTR InstName C14
SYMATTR Value 22n
SYMBOL res 7120 800 R90
WINDOW 0 0 56 VBottom 2
WINDOW 3 32 56 VTop 2
SYMATTR InstName R109
SYMATTR Value 13950
SYMBOL res 7296 800 R90
WINDOW 0 0 56 VBottom 2
WINDOW 3 32 56 VTop 2
SYMATTR InstName R110
SYMATTR Value 127.87k
SYMBOL res 6704 1040 R90
WINDOW 0 0 56 VBottom 2
WINDOW 3 32 56 VTop 2
SYMATTR InstName R111
SYMATTR Value 234.16k
SYMBOL res 7472 672 R90
WINDOW 0 0 56 VBottom 2
WINDOW 3 32 56 VTop 2
SYMATTR InstName R112
SYMATTR Value 6.321k
SYMBOL Opamps\\UniversalOpamp2 7552 704 R0
SYMATTR InstName U18
SYMBOL res 7616 576 R90
WINDOW 0 0 56 VBottom 2
WINDOW 3 32 56 VTop 2
SYMATTR InstName R114
SYMATTR Value 257.7k
SYMBOL res 7840 688 R90
WINDOW 0 0 56 VBottom 2
WINDOW 3 32 56 VTop 2
SYMATTR InstName R116
SYMATTR Value 7.180k
SYMBOL res 7984 688 R90
WINDOW 0 0 56 VBottom 2
WINDOW 3 32 56 VTop 2
SYMATTR InstName R117
SYMATTR Value 511.93k
SYMBOL res 7984 608 R90
WINDOW 0 0 56 VBottom 2
WINDOW 3 32 56 VTop 2
SYMATTR InstName R118
SYMATTR Value 251.26k
SYMBOL res 7984 528 R90
WINDOW 0 0 56 VBottom 2
WINDOW 3 32 56 VTop 2
SYMATTR InstName R119
SYMATTR Value 122.94k
SYMBOL res 7984 768 R90
WINDOW 0 0 56 VBottom 2
WINDOW 3 32 56 VTop 2
SYMATTR InstName R120
SYMATTR Value 965.31k
SYMBOL res 8176 688 R90
WINDOW 0 0 56 VBottom 2
WINDOW 3 32 56 VTop 2
SYMATTR InstName R121
SYMATTR Value 4.396k
SYMBOL Opamps\\UniversalOpamp2 8256 720 R0
SYMATTR InstName U19
SYMBOL res 8320 592 R90
WINDOW 0 0 56 VBottom 2
WINDOW 3 32 56 VTop 2
SYMATTR InstName R122
SYMATTR Value 69.091k
SYMBOL res 8640 704 R90
WINDOW 0 0 56 VBottom 2
WINDOW 3 32 56 VTop 2
SYMATTR InstName R124
SYMATTR Value 482.76
SYMBOL res 8656 736 R0
SYMATTR InstName R125
SYMATTR Value 1k
SYMBOL res 8816 704 R90
WINDOW 0 0 56 VBottom 2
WINDOW 3 32 56 VTop 2
SYMATTR InstName R126
SYMATTR Value 10k
SYMBOL cap 8832 768 R0
SYMATTR InstName C15
SYMATTR Value 1n
SYMBOL npn 8960 672 R0
SYMATTR InstName Q3
SYMATTR Value 2SC1815
SYMBOL cap 9008 800 R90
WINDOW 0 0 32 VBottom 2
WINDOW 3 32 32 VTop 2
SYMATTR InstName C16
SYMATTR Value 470p
SYMBOL res 9008 800 R0
SYMATTR InstName R127
SYMATTR Value 1k
SYMBOL cap 9168 800 R90
WINDOW 0 0 32 VBottom 2
WINDOW 3 32 32 VTop 2
SYMATTR InstName C17
SYMATTR Value 10µ
SYMBOL res 7120 416 R90
WINDOW 0 0 56 VBottom 2
WINDOW 3 32 56 VTop 2
SYMATTR InstName R128
SYMATTR Value 297.81k
SYMBOL res 8448 592 R90
WINDOW 0 0 56 VBottom 2
WINDOW 3 32 56 VTop 2
SYMATTR InstName R133
SYMATTR Value 259.26
SYMBOL voltage 4512 1680 R0
WINDOW 123 24 124 Left 2
WINDOW 39 0 0 Left 0
SYMATTR Value2 AC 1
SYMATTR InstName Vin3
SYMATTR Value SINE(0 2 2.1k)
SYMBOL res 5184 1648 R90
WINDOW 0 0 56 VBottom 2
WINDOW 3 32 56 VTop 2
SYMATTR InstName R105
SYMATTR Value 368.91k
SYMBOL Opamps\\UniversalOpamp2 5424 1680 R0
SYMATTR InstName U20
SYMBOL cap 4688 1648 R90
WINDOW 0 0 32 VBottom 2
WINDOW 3 32 32 VTop 2
SYMATTR InstName C18
SYMATTR Value .1µ
SYMBOL res 5776 1776 R90
WINDOW 0 0 56 VBottom 2
WINDOW 3 32 56 VTop 2
SYMATTR InstName R115
SYMATTR Value 1k
SYMBOL res 5632 1808 R0
SYMATTR InstName R123
SYMATTR Value 215.38k
SYMBOL Opamps\\UniversalOpamp2 5856 1808 R0
SYMATTR InstName U21
SYMBOL cap 5936 1904 R90
WINDOW 0 0 32 VBottom 2
WINDOW 3 32 32 VTop 2
SYMATTR InstName C19
SYMATTR Value 22n
SYMBOL res 6016 2224 R90
WINDOW 0 0 56 VBottom 2
WINDOW 3 32 56 VTop 2
SYMATTR InstName R135
SYMATTR Value 103.18k
SYMBOL Opamps\\UniversalOpamp2 5808 2256 M0
SYMATTR InstName U22
SYMBOL res 5808 2368 R90
WINDOW 0 0 56 VBottom 2
WINDOW 3 32 56 VTop 2
SYMATTR InstName R137
SYMATTR Value 45.278k
SYMBOL res 5456 2240 R90
WINDOW 0 0 56 VBottom 2
WINDOW 3 32 56 VTop 2
SYMATTR InstName R138
SYMATTR Value 215.38k
SYMBOL res 6352 1904 R90
WINDOW 0 0 56 VBottom 2
WINDOW 3 32 56 VTop 2
SYMATTR InstName R139
SYMATTR Value 1k
SYMBOL Opamps\\UniversalOpamp2 6496 1936 R0
SYMATTR InstName U23
SYMBOL cap 6576 2032 R90
WINDOW 0 0 32 VBottom 2
WINDOW 3 32 32 VTop 2
SYMATTR InstName C20
SYMATTR Value 22n
SYMBOL Opamps\\UniversalOpamp2 7376 1824 R0
SYMATTR InstName U24
SYMBOL res 7440 1696 R90
WINDOW 0 0 56 VBottom 2
WINDOW 3 32 56 VTop 2
SYMATTR InstName R145
SYMATTR Value 257.7k
SYMBOL res 7808 1808 R90
WINDOW 0 0 56 VBottom 2
WINDOW 3 32 56 VTop 2
SYMATTR InstName R147
SYMATTR Value 511.93k
SYMBOL res 7808 1728 R90
WINDOW 0 0 56 VBottom 2
WINDOW 3 32 56 VTop 2
SYMATTR InstName R148
SYMATTR Value 251.26k
SYMBOL res 7808 1648 R90
WINDOW 0 0 56 VBottom 2
WINDOW 3 32 56 VTop 2
SYMATTR InstName R149
SYMATTR Value 122.94k
SYMBOL res 7808 1888 R90
WINDOW 0 0 56 VBottom 2
WINDOW 3 32 56 VTop 2
SYMATTR InstName R150
SYMATTR Value 965.31k
SYMBOL Opamps\\UniversalOpamp2 8080 1840 R0
SYMATTR InstName U25
SYMBOL res 8144 1712 R90
WINDOW 0 0 56 VBottom 2
WINDOW 3 32 56 VTop 2
SYMATTR InstName R152
SYMATTR Value 69.091k
SYMBOL res 8640 1824 R90
WINDOW 0 0 56 VBottom 2
WINDOW 3 32 56 VTop 2
SYMATTR InstName R155
SYMATTR Value 10k
SYMBOL cap 8656 1888 R0
SYMATTR InstName C21
SYMATTR Value 1n
SYMBOL npn 8784 1792 R0
SYMATTR InstName Q4
SYMATTR Value 2SC1815
SYMBOL res 8832 1920 R0
SYMATTR InstName R156
SYMATTR Value 1k
SYMBOL cap 8992 1920 R90
WINDOW 0 0 32 VBottom 2
WINDOW 3 32 32 VTop 2
SYMATTR InstName C23
SYMATTR Value 10µ
SYMBOL res 6944 1536 R90
WINDOW 0 0 56 VBottom 2
WINDOW 3 32 56 VTop 2
SYMATTR InstName R157
SYMATTR Value 297.81k
SYMBOL res 6528 2160 R90
WINDOW 0 0 56 VBottom 2
WINDOW 3 32 56 VTop 2
SYMATTR InstName R89
SYMATTR Value 215.38k
SYMBOL res 7120 1920 R90
WINDOW 0 0 56 VBottom 2
WINDOW 3 32 56 VTop 2
SYMATTR InstName R106
SYMATTR Value 162k
SYMBOL res 7120 1792 R90
WINDOW 0 0 56 VBottom 2
WINDOW 3 32 56 VTop 2
SYMATTR InstName R107
SYMATTR Value 162k
SYMBOL res 7120 1664 R90
WINDOW 0 0 56 VBottom 2
WINDOW 3 32 56 VTop 2
SYMATTR InstName R108
SYMATTR Value 162k
TEXT -224 -40 Left 2 !;tran 1
TEXT -80 416 Left 2 ;1-10u\n.1u in 250469 schematics
TEXT 2168 512 Left 2 ;HP
TEXT 888 600 Left 2 ;freq dac
TEXT 2176 640 Left 2 ;BP
TEXT 1176 1160 Left 2 ;RES3=0, RES2=0: 37.055k\nRES3=0, RES2=1: 51.113k\nRES3=1, RES2=0: 72.38k\nRES3=1, RES2=1: 103.18k
TEXT 840 1312 Left 2 ;RES1=0, RES0=0: 58.975k\nRES1=0, RES0=1: 45.278k\nRES1=1, RES0=0: 47.67k\nRES1=1, RES0=1: 53.97k
TEXT 1464 728 Left 2 ;freq dac
TEXT 2176 768 Left 2 ;LP
TEXT -368 -8 Left 2 !.ac oct 100 1 1MEG
TEXT 3024 504 Left 2 ;VOL3
TEXT 3024 584 Left 2 ;VOL2
TEXT 3024 664 Left 2 ;VOL1
TEXT 3024 744 Left 2 ;VOL0
TEXT 2136 376 Left 2 ;bypass
TEXT -192 1488 Left 2 ;1-10u\n.1u in 250469 schematics
TEXT 1992 1584 Left 2 ;HP
TEXT 776 1672 Left 2 ;freq dac
TEXT 2000 1712 Left 2 ;BP
TEXT 1064 2232 Left 2 ;RES3=0, RES2=0: 37.055k\nRES3=0, RES2=1: 51.113k\nRES3=1, RES2=0: 72.38k\nRES3=1, RES2=1: 103.18k
TEXT 728 2384 Left 2 ;RES1=0, RES0=0: 58.975k\nRES1=0, RES0=1: 45.278k\nRES1=1, RES0=0: 47.67k\nRES1=1, RES0=1: 53.97k
TEXT 1352 1800 Left 2 ;freq dac
TEXT 2000 1840 Left 2 ;LP
TEXT 2848 1576 Left 2 ;VOL3
TEXT 2848 1656 Left 2 ;VOL2
TEXT 2848 1736 Left 2 ;VOL1
TEXT 2848 1816 Left 2 ;VOL0
TEXT 1960 1448 Left 2 ;bypass
TEXT 72 1664 Left 2 ;PolySi
TEXT 328 1664 Left 2 ;PolySi
TEXT 176 584 Left 2 ;PolySi
TEXT 440 584 Left 2 ;PolySi
TEXT 2072 600 Left 2 ;PolySi
TEXT 2072 728 Left 2 ;PolySi
TEXT 2072 856 Left 2 ;PolySi
TEXT 1896 1672 Left 2 ;PolySi
TEXT 1896 1800 Left 2 ;PolySi
TEXT 1896 1928 Left 2 ;PolySi
TEXT 1192 1800 Left 2 ;PolySi
TEXT 648 1776 Left 2 ;PolySi
TEXT 1304 728 Left 2 ;PolySi
TEXT 752 712 Left 2 ;PolySi
TEXT 1296 1056 Left 2 ;PolySi
TEXT 1136 720 Left 2 ;PolySi
TEXT 1768 856 Left 2 ;PolySi
TEXT 760 1176 Left 2 ;PolySi
TEXT 40 576 Left 2 ;diffusion
TEXT 2424 720 Left 2 ;PolySi
TEXT 584 968 Left 2 ;diffusion
TEXT 880 880 Left 2 ;diffusion
TEXT 976 840 Left 2 ;diffusion
TEXT 1160 832 Left 2 ;diffusion
TEXT 1864 856 Left 2 ;diffusion
TEXT 1616 968 Left 2 ;diffusion
TEXT 1856 968 Left 2 ;diffusion
TEXT 2648 744 Left 2 ;diffusion
TEXT 2792 744 Left 2 ;PolySi
TEXT 352 248 Left 2 ;PolySi
TEXT 616 200 Left 2 ;diffusion
TEXT 2696 936 Left 2 ;diffusion
TEXT 3128 744 Left 2 ;PolySi
TEXT 3360 760 Left 2 ;diffusion
TEXT 3592 760 Left 2 ;PolySi
TEXT 3400 648 Left 2 ;PolySi
TEXT 4880 432 Left 2 ;1-10u\n.1u in 250469 schematics
TEXT 7128 528 Left 2 ;HP
TEXT 5848 616 Left 2 ;freq dac
TEXT 7136 656 Left 2 ;BP
TEXT 6136 1176 Left 2 ;RES3=0, RES2=0: 37.055k\nRES3=0, RES2=1: 51.113k\nRES3=1, RES2=0: 72.38k\nRES3=1, RES2=1: 103.18k
TEXT 5800 1328 Left 2 ;RES1=0, RES0=0: 58.975k\nRES1=0, RES0=1: 45.278k\nRES1=1, RES0=0: 47.67k\nRES1=1, RES0=1: 53.97k
TEXT 6424 744 Left 2 ;freq dac
TEXT 7136 784 Left 2 ;LP
TEXT 7984 520 Left 2 ;VOL3
TEXT 7984 600 Left 2 ;VOL2
TEXT 7984 680 Left 2 ;VOL1
TEXT 7984 760 Left 2 ;VOL0
TEXT 7096 392 Left 2 ;bypass
TEXT 5136 600 Left 2 ;PolySi
TEXT 5400 600 Left 2 ;PolySi
TEXT 7032 616 Left 2 ;PolySi
TEXT 7032 744 Left 2 ;PolySi
TEXT 7032 872 Left 2 ;PolySi
TEXT 6264 744 Left 2 ;PolySi
TEXT 5712 728 Left 2 ;PolySi
TEXT 6256 1072 Left 2 ;PolySi
TEXT 6096 736 Left 2 ;PolySi
TEXT 6728 872 Left 2 ;PolySi
TEXT 5720 1192 Left 2 ;PolySi
TEXT 7384 736 Left 2 ;PolySi
TEXT 7752 760 Left 2 ;PolySi
TEXT 8088 760 Left 2 ;PolySi
TEXT 8552 776 Left 2 ;PolySi
TEXT 8360 664 Left 2 ;PolySi
TEXT 880 1168 Left 2 ;diffusion
TEXT 4704 1552 Left 2 ;1-10u\n.1u in 250469 schematics
TEXT 6952 1648 Left 2 ;HP
TEXT 5672 1736 Left 2 ;freq dac
TEXT 6960 1776 Left 2 ;BP
TEXT 5960 2296 Left 2 ;RES3=0, RES2=0: 37.055k\nRES3=0, RES2=1: 51.113k\nRES3=1, RES2=0: 72.38k\nRES3=1, RES2=1: 103.18k
TEXT 5624 2448 Left 2 ;RES1=0, RES0=0: 58.975k\nRES1=0, RES0=1: 53.97k\nRES1=1, RES0=0: 47.67k\nRES1=1, RES0=1: 45.278k
TEXT 6248 1864 Left 2 ;freq dac
TEXT 6960 1904 Left 2 ;LP
TEXT 7808 1640 Left 2 ;VOL3
TEXT 7808 1720 Left 2 ;VOL2
TEXT 7808 1800 Left 2 ;VOL1
TEXT 7808 1880 Left 2 ;VOL0
TEXT 6920 1512 Left 2 ;bypass

The netlist it stands for:
* 8580.asc
V1 V5 0 5
V2 V9 0 9
R1 V5 N001 90.708k
R2 N001 0 90.358k
R3 N002 N001 36.138k
R4 V5 N002 8.75k
XU1 N002 Vref V9 0 N003 level.2 Avol=1Meg GBW=10Meg Slew=10Meg ilimit=25m rail=0 Vos=0 phimargin=45 en=0 enk=0 in=0 ink=0 Rin=500Meg  ; pins IN+ IN- V+ V- OUT
R5 Vref N003 152.9
Vin N007 0 SINE(0 2 1k) AC 1
R6 N004 N009 6199.6
R7 N010 N004 368.91k
R8 N011 N010 6.682k
XU2 Vref N011 V9 0 N014 level.2 Avol=1Meg GBW=10Meg Slew=10Meg ilimit=25m rail=0 Vos=0 phimargin=45 en=0 enk=0 in=0 ink=0 Rin=500Meg  ; pins IN+ IN- V+ V- OUT
C1 N008 N007 .1µ
R9 NC_01 N014 15371.5
R10 N005 NC_02 137.88k
R11 N033 N014 4.802k
R12 N034 N033 1k
R13 N063 N011 169.2
R14 N033 N050 215.38k
XU3 Vref N034 V9 0 N035 level.2 Avol=1Meg GBW=10Meg Slew=10Meg ilimit=25m rail=0 Vos=0 phimargin=45 en=0 enk=0 in=0 ink=0 Rin=500Meg  ; pins IN+ IN- V+ V- OUT
R15 N036 N035 920.4
C2 N052 N051 22n
R16 N037 N036 1.368k
R17 NC_03 N037 5.070k
R18 N005 NC_04 148.87k
R19 N037 N067 943.9
R20 N067 N066 103.18k
XU4 Vref N066 V9 0 N070 level.2 Avol=1Meg GBW=10Meg Slew=10Meg ilimit=25m rail=0 Vos=0 phimargin=45 en=0 enk=0 in=0 ink=0 Rin=500Meg  ; pins IN+ IN- V+ V- OUT
R21 N069 N068 1.027k
R22 N066 N068 53.97k
R23 N068 N011 215.38k
R24 N053 N036 1k
XU5 Vref N053 V9 0 N054 level.2 Avol=1Meg GBW=10Meg Slew=10Meg ilimit=25m rail=0 Vos=0 phimargin=45 en=0 enk=0 in=0 ink=0 Rin=500Meg  ; pins IN+ IN- V+ V- OUT
R25 N055 N054 827.3
R26 N051 N034 350
R27 N036 N052 350
C3 N065 N064 22n
R28 N064 N053 350
R29 N056 N065 350
R30 NC_05 N056 13950
R31 N005 NC_06 127.87k
R32 N056 N063 234.16k
R33 N023 N005 6.321k
XU6 N044 N023 V9 0 N040 level.2 Avol=1Meg GBW=10Meg Slew=10Meg ilimit=25m rail=0 Vos=0 phimargin=45 en=0 enk=0 in=0 ink=0 Rin=500Meg  ; pins IN+ IN- V+ V- OUT
R34 N044 Vref 26.31
R35 N024 N023 257.7k
R36 N024 N040 147
R37 N012 N024 7.180k
R38 N013 N012 511.93k
R39 N013 N012 251.26k
R40 N013 N012 122.94k
R41 N013 N012 965.31k
R42 N025 N013 4.396k
XU7 N044 N025 V9 0 N045 level.2 Avol=1Meg GBW=10Meg Slew=10Meg ilimit=25m rail=0 Vos=0 phimargin=45 en=0 enk=0 in=0 ink=0 Rin=500Meg  ; pins IN+ IN- V+ V- OUT
R43 N026 N025 69.091k
R44 N027 N045 152.9
R45 N046 N027 482.76
R46 NC_07 0 1k
R47 N047 N046 10k
C4 N047 0 1n
Q1 V9 N047 N057 0 2SC1815
C5 N057 N047 470p
R48 N057 0 1k
C6 NC_08 N057 10µ
R49 N005 N004 297.81k
Vin1 N078 0 SINE(0 2 1k) AC 1
R50 N075 N079 6234.6
R51 N080 N075 368.91k
R52 N081 N080 6.682k
XU8 Vref N081 V9 0 N084 level.2 Avol=1Meg GBW=10Meg Slew=10Meg ilimit=25m rail=0 Vos=0 phimargin=45 en=0 enk=0 in=0 ink=0 Rin=500Meg  ; pins IN+ IN- V+ V- OUT
C7 N079 N078 .1µ
R53 NC_09 N084 15371.5
R54 N076 NC_10 137.88k
R55 N095 N084 4.802k
R56 N096 N095 3k
R58 N095 N081 215576
XU9 Vref N096 V9 0 N098 level.2 Avol=1Meg GBW=10Meg Slew=10Meg ilimit=25m rail=0 Vos=0 phimargin=45 en=0 enk=0 in=0 ink=0 Rin=500Meg  ; pins IN+ IN- V+ V- OUT
C8 N098 N096 22n
R60 N099 N098 1.368k
R61 NC_11 N099 5.070k
R62 N076 NC_12 148.87k
R64 N099 N110 103.18k
XU10 Vref N110 V9 0 N111 level.2 Avol=1Meg GBW=10Meg Slew=10Meg ilimit=25m rail=0 Vos=0 phimargin=45 en=0 enk=0 in=0 ink=0 Rin=500Meg  ; pins IN+ IN- V+ V- OUT
R66 N110 N111 53.97k
R67 N111 N081 215.38k
R68 N104 N098 3k
XU11 Vref N104 V9 0 N105 level.2 Avol=1Meg GBW=10Meg Slew=10Meg ilimit=25m rail=0 Vos=0 phimargin=45 en=0 enk=0 in=0 ink=0 Rin=500Meg  ; pins IN+ IN- V+ V- OUT
C9 N105 N104 22n
R74 NC_13 N105 13950
R75 N076 NC_14 127.87k
R76 N105 N081 234.16k
R77 N085 N076 6.321k
XU12 Vref N085 V9 0 N086 level.2 Avol=1Meg GBW=10Meg Slew=10Meg ilimit=25m rail=0 Vos=0 phimargin=45 en=0 enk=0 in=0 ink=0 Rin=500Meg  ; pins IN+ IN- V+ V- OUT
R79 N086 N085 257.7k
R81 N082 N086 7.180k
R82 N083 N082 511.93k
R83 N083 N082 251.26k
R84 N083 N082 122.94k
R85 N083 N082 965.31k
R86 N087 N083 4.396k
XU13 Vref N087 V9 0 N088 level.2 Avol=1Meg GBW=10Meg Slew=10Meg ilimit=25m rail=0 Vos=0 phimargin=45 en=0 enk=0 in=0 ink=0 Rin=500Meg  ; pins IN+ IN- V+ V- OUT
R87 N088 N087 69350.26
R91 N100 N088 10k
C10 N100 0 1n
Q2 V9 N100 N106 0 2SC1815
R92 N106 0 1k
C12 NC_15 N106 10µ
R93 N076 N075 297.81k
R57 N056 N055 154.7
R59 N070 N069 147
R63 N009 N008 35
R65 N050 N063 196
R69 N027 N026 259.26
Vin2 N015 0 SINE(0 2 1k) AC 1
R70 N006 N016 6199.6
R71 N017 N006 368.91k
R72 N018 N017 6.682k
XU14 Vref N018 V9 0 N021 level.2 Avol=1Meg GBW=10Meg Slew=10Meg ilimit=25m rail=0 Vos=0 phimargin=45 en=0 enk=0 in=0 ink=0 Rin=500Meg  ; pins IN+ IN- V+ V- OUT
C11 N016 N015 .1µ
R73 NC_16 N021 15371.5
R78 N022 NC_17 137.88k
R80 N038 N021 4.802k
R88 N039 N038 6k
R90 N038 N018 215.38k
XU15 Vref N039 V9 0 N041 level.2 Avol=1Meg GBW=10Meg Slew=10Meg ilimit=25m rail=0 Vos=0 phimargin=45 en=0 enk=0 in=0 ink=0 Rin=500Meg  ; pins IN+ IN- V+ V- OUT
R94 N042 N041 920.4
C13 N042 N039 22n
R95 N043 N042 1.368k
R96 NC_18 N043 5.070k
R97 N022 NC_19 148.87k
R98 N043 N072 943.9
R99 N072 N071 103.18k
XU16 Vref N071 V9 0 N074 level.2 Avol=1Meg GBW=10Meg Slew=10Meg ilimit=25m rail=0 Vos=0 phimargin=45 en=0 enk=0 in=0 ink=0 Rin=500Meg  ; pins IN+ IN- V+ V- OUT
R100 N074 N073 1.027k
R101 N071 N073 53.97k
R102 N073 N018 215.38k
R103 N058 N042 6k
XU17 Vref N058 V9 0 N059 level.2 Avol=1Meg GBW=10Meg Slew=10Meg ilimit=25m rail=0 Vos=0 phimargin=45 en=0 enk=0 in=0 ink=0 Rin=500Meg  ; pins IN+ IN- V+ V- OUT
R104 N060 N059 827.3
C14 N060 N058 22n
R109 N061 N060 13950
R110 N022 N061 127.87k
R111 N060 N018 234.16k
R112 N028 N022 6.321k
XU18 Vref N028 V9 0 N029 level.2 Avol=1Meg GBW=10Meg Slew=10Meg ilimit=25m rail=0 Vos=0 phimargin=45 en=0 enk=0 in=0 ink=0 Rin=500Meg  ; pins IN+ IN- V+ V- OUT
R114 N029 N028 257.7k
R116 N019 N029 7.180k
R117 N020 N019 511.93k
R118 N020 N019 251.26k
R119 N020 N019 122.94k
R120 N020 N019 965.31k
R121 N030 N020 4.396k
XU19 Vref N030 V9 0 N032 level.2 Avol=1Meg GBW=10Meg Slew=10Meg ilimit=25m rail=0 Vos=0 phimargin=45 en=0 enk=0 in=0 ink=0 Rin=500Meg  ; pins IN+ IN- V+ V- OUT
R122 N031 N030 69.091k
R124 N048 N032 482.76
R125 NC_20 0 1k
R126 N049 N048 10k
C15 N049 0 1n
Q3 V9 N049 N062 0 2SC1815
C16 N062 N049 470p
R127 N062 0 1k
C17 NC_21 N062 10µ
R128 NC_22 N006 297.81k
R133 N032 N031 259.26
Vin3 N089 0 SINE(0 2 2.1k) AC 1
R105 N090 N077 368.91k
XU20 Vref N090 V9 0 N093 level.2 Avol=1Meg GBW=10Meg Slew=10Meg ilimit=25m rail=0 Vos=0 phimargin=45 en=0 enk=0 in=0 ink=0 Rin=500Meg  ; pins IN+ IN- V+ V- OUT
C18 N077 N089 .1µ
R115 N101 N093 1k
R123 N093 N090 215.38k
XU21 Vref N101 V9 0 N102 level.2 Avol=1Meg GBW=10Meg Slew=10Meg ilimit=25m rail=0 Vos=0 phimargin=45 en=0 enk=0 in=0 ink=0 Rin=500Meg  ; pins IN+ IN- V+ V- OUT
C19 N102 N101 22n
R135 N102 N112 103.18k
XU22 Vref N112 V9 0 N113 level.2 Avol=1Meg GBW=10Meg Slew=10Meg ilimit=25m rail=0 Vos=0 phimargin=45 en=0 enk=0 in=0 ink=0 Rin=500Meg  ; pins IN+ IN- V+ V- OUT
R137 N112 N113 45.278k
R138 N113 N090 215.38k
R139 N107 N102 1k
XU23 Vref N107 V9 0 N108 level.2 Avol=1Meg GBW=10Meg Slew=10Meg ilimit=25m rail=0 Vos=0 phimargin=45 en=0 enk=0 in=0 ink=0 Rin=500Meg  ; pins IN+ IN- V+ V- OUT
C20 N108 N107 22n
XU24 Vref N094 V9 0 N091 level.2 Avol=1Meg GBW=10Meg Slew=10Meg ilimit=25m rail=0 Vos=0 phimargin=45 en=0 enk=0 in=0 ink=0 Rin=500Meg  ; pins IN+ IN- V+ V- OUT
R145 N091 N094 257.7k
R147 N092 N091 511.93k
R148 N092 N091 251.26k
R149 N092 N091 122.94k
R150 N092 N091 965.31k
XU25 Vref N092 V9 0 N097 level.2 Avol=1Meg GBW=10Meg Slew=10Meg ilimit=25m rail=0 Vos=0 phimargin=45 en=0 enk=0 in=0 ink=0 Rin=500Meg  ; pins IN+ IN- V+ V- OUT
R152 N097 N092 69.091k
R155 N103 N097 10k
C21 N103 0 1n
Q4 V9 N103 N109 0 2SC1815
R156 N109 0 1k
C23 NC_23 N109 10µ
R157 NC_24 N077 297.81k
R89 N108 N090 215.38k
R106 N094 N108 162k
R107 N094 NC_25 162k
R108 N094 NC_26 162k
.model NPN NPN
.model PNP PNP
.lib standard.bjt
;tran 1
* 1-10u
* .1u in 250469 schematics
* HP
* freq dac
* BP
* RES3=0, RES2=0: 37.055k
* RES3=0, RES2=1: 51.113k
* RES3=1, RES2=0: 72.38k
* RES3=1, RES2=1: 103.18k
* RES1=0, RES0=0: 58.975k
* RES1=0, RES0=1: 45.278k
* RES1=1, RES0=0: 47.67k
* RES1=1, RES0=1: 53.97k
* freq dac
* LP
.ac oct 100 1 1MEG
* VOL3
* VOL2
* VOL1
* VOL0
* bypass
* 1-10u
* .1u in 250469 schematics
* HP
* freq dac
* BP
* RES3=0, RES2=0: 37.055k
* RES3=0, RES2=1: 51.113k
* RES3=1, RES2=0: 72.38k
* RES3=1, RES2=1: 103.18k
* RES1=0, RES0=0: 58.975k
* RES1=0, RES0=1: 45.278k
* RES1=1, RES0=0: 47.67k
* RES1=1, RES0=1: 53.97k
* freq dac
* LP
* VOL3
* VOL2
* VOL1
* VOL0
* bypass
* PolySi
* PolySi
* PolySi
* PolySi
* PolySi
* PolySi
* PolySi
* PolySi
* PolySi
* PolySi
* PolySi
* PolySi
* PolySi
* PolySi
* PolySi
* PolySi
* PolySi
* PolySi
* diffusion
* PolySi
* diffusion
* diffusion
* diffusion
* diffusion
* diffusion
* diffusion
* diffusion
* diffusion
* PolySi
* PolySi
* diffusion
* diffusion
* PolySi
* diffusion
* PolySi
* PolySi
* 1-10u
* .1u in 250469 schematics
* HP
* freq dac
* BP
* RES3=0, RES2=0: 37.055k
* RES3=0, RES2=1: 51.113k
* RES3=1, RES2=0: 72.38k
* RES3=1, RES2=1: 103.18k
* RES1=0, RES0=0: 58.975k
* RES1=0, RES0=1: 45.278k
* RES1=1, RES0=0: 47.67k
* RES1=1, RES0=1: 53.97k
* freq dac
* LP
* VOL3
* VOL2
* VOL1
* VOL0
* bypass
* PolySi
* PolySi
* PolySi
* PolySi
* PolySi
* PolySi
* PolySi
* PolySi
* PolySi
* PolySi
* PolySi
* PolySi
* PolySi
* PolySi
* PolySi
* PolySi
* diffusion
* 1-10u
* .1u in 250469 schematics
* HP
* freq dac
* BP
* RES3=0, RES2=0: 37.055k
* RES3=0, RES2=1: 51.113k
* RES3=1, RES2=0: 72.38k
* RES3=1, RES2=1: 103.18k
* RES1=0, RES0=0: 58.975k
* RES1=0, RES0=1: 53.97k
* RES1=1, RES0=0: 47.67k
* RES1=1, RES0=1: 45.278k
* freq dac
* LP
* VOL3
* VOL2
* VOL1
* VOL0
* bypass
.lib UniversalOpamps2.sub
.backanno
.end